# Altium schematic sheet Supply.SchDoc
size A; SheetNumber: 4; SheetTotal: 4
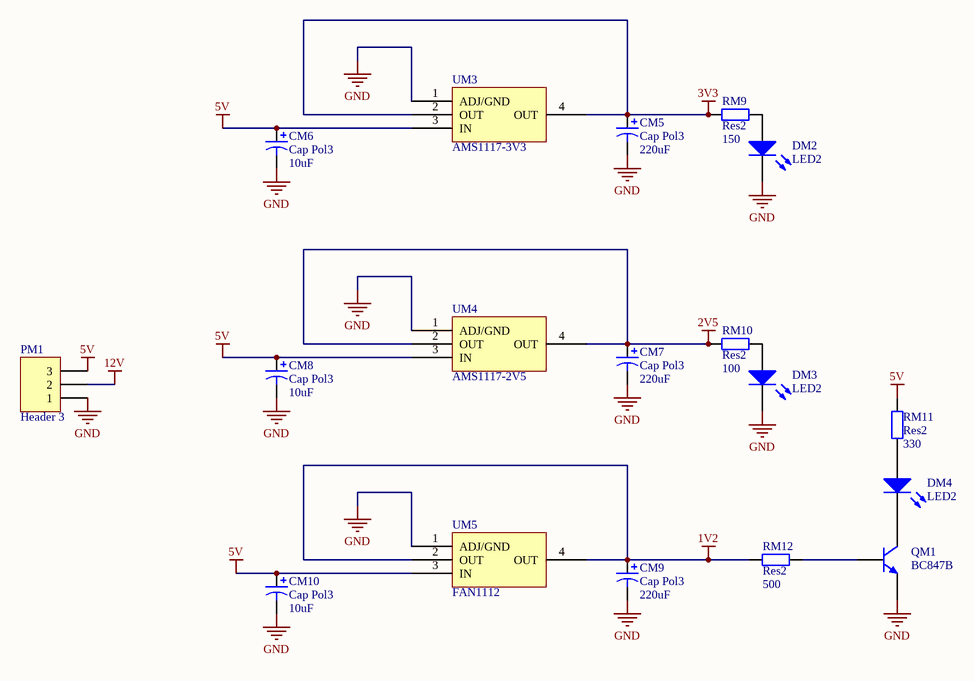
[diagram p0: Supply.SchDoc]

## Parts
CM5  Cap Pol3  value 220uF  [SIZE D]
CM6  Cap Pol3  value 10uF  [SIZE B]
CM7  Cap Pol3  value 220uF  [SIZE D]
CM8  Cap Pol3  value 10uF  [SIZE B]
CM9  Cap Pol3  value 220uF  [SIZE D]
CM10  Cap Pol3  value 10uF  [SIZE B]
DM2  LED2  [3.2X1.6X1.1]
DM3  LED2  [3.2X1.6X1.1]
DM4  LED2  [3.2X1.6X1.1]
PM1  Header 3  [HDR1X3]
QM1  BC847B  [SOT23_M]
RM9  Res2  value 150  [6-0805_N]
RM10  Res2  value 100  [6-0805_N]
RM11  Res2  value 330  [6-0805_N]
RM12  Res2  value 500  [6-0805_N]
UM3  AMS1117-3V3  [TO-252]
UM4  AMS1117-2V5  [TO-252]
UM5  FAN1112  [TO-252]

## Nets
1V2: CM9.1 RM12.1 UM5.2(OUT) UM5.4(OUT)
2V5: CM7.1 RM10.1 UM4.2(OUT) UM4.4(OUT)
3V3: CM5.1 RM9.1 UM3.2(OUT) UM3.4(OUT)
5V: CM6.1 CM8.1 CM10.1 PM1.3 RM11.2 UM3.3(IN) UM4.3(IN) UM5.3(IN)
12V: PM1.2
GND: CM5.2 CM6.2 CM7.2 CM8.2 CM9.2 CM10.2 DM2.2(K) DM3.2(K) PM1.1 QM1.3(E) UM3.1(ADJ/GND) UM4.1(ADJ/GND) UM5.1(ADJ/GND)
NetDM2_1: DM2.1(A) RM9.2
NetDM3_1: DM3.1(A) RM10.2
NetDM4_1: DM4.1(A) RM11.1
NetDM4_2: DM4.2(K) QM1.1(C)
NetQM1_2: QM1.2(B) RM12.2

## Library data of the parts
CM5-CM10 = Cap Pol3: Polarized Capacitor (Surface Mount); Published: 8-Jun-2000; LatestRevisionDate: 29-May-2009; LatestRevisionNote: IPC-7351 Footprint Added.; PackageReference: C0805; Publisher: Altium Limited; PackageDescription: Chip Capacitor
DM2-DM4 = LED2: Typical RED, GREEN, YELLOW, AMBER GaAs LED; Published: 8-Jun-2000; LatestRevisionDate: 17-Jul-2002; LatestRevisionNote: Re-released for DXP Platform.; PackageVersion: Feb-2002; PackageReference: 3.2X1.6X1.1; Publisher: Altium Limited; PackageDescription: SM LED; 2 Flat Leads
PM1 = Header 3: Header, 3-Pin; LatestRevisionDate: 17-Jul-2002; LatestRevisionNote: Re-released for DXP Platform.; Publisher: Altium Limited
QM1 = NPN: NPN Bipolar Transistor; Published: 8-Jun-2000; LatestRevisionDate: 17-Jul-2002; LatestRevisionNote: Re-released for DXP Platform.; PackageReference: TO-226-AA; Publisher: Altium Limited; PackageDescription: TO, Flat Index; 3 In-Line, Axial Leads; Body Dia. 4.8mm; Leads 0.55 x 0.51 mm (max); Code_JEDEC: TO-226-AA
RM9-RM12 = Res2: Resistor; Published: 8-Jun-2000; LatestRevisionDate: 17-Jul-2002; LatestRevisionNote: Re-released for DXP Platform.; PackageReference: AXIAL-0.4; Publisher: Altium Limited; PackageDescription: Axial Device, Thru-Hole; 2 Leads; 0.4 in Pin Spacing
UM3-UM5 = AMS1117-3.3V